# Altium project 202011AWSN.PrjPcb
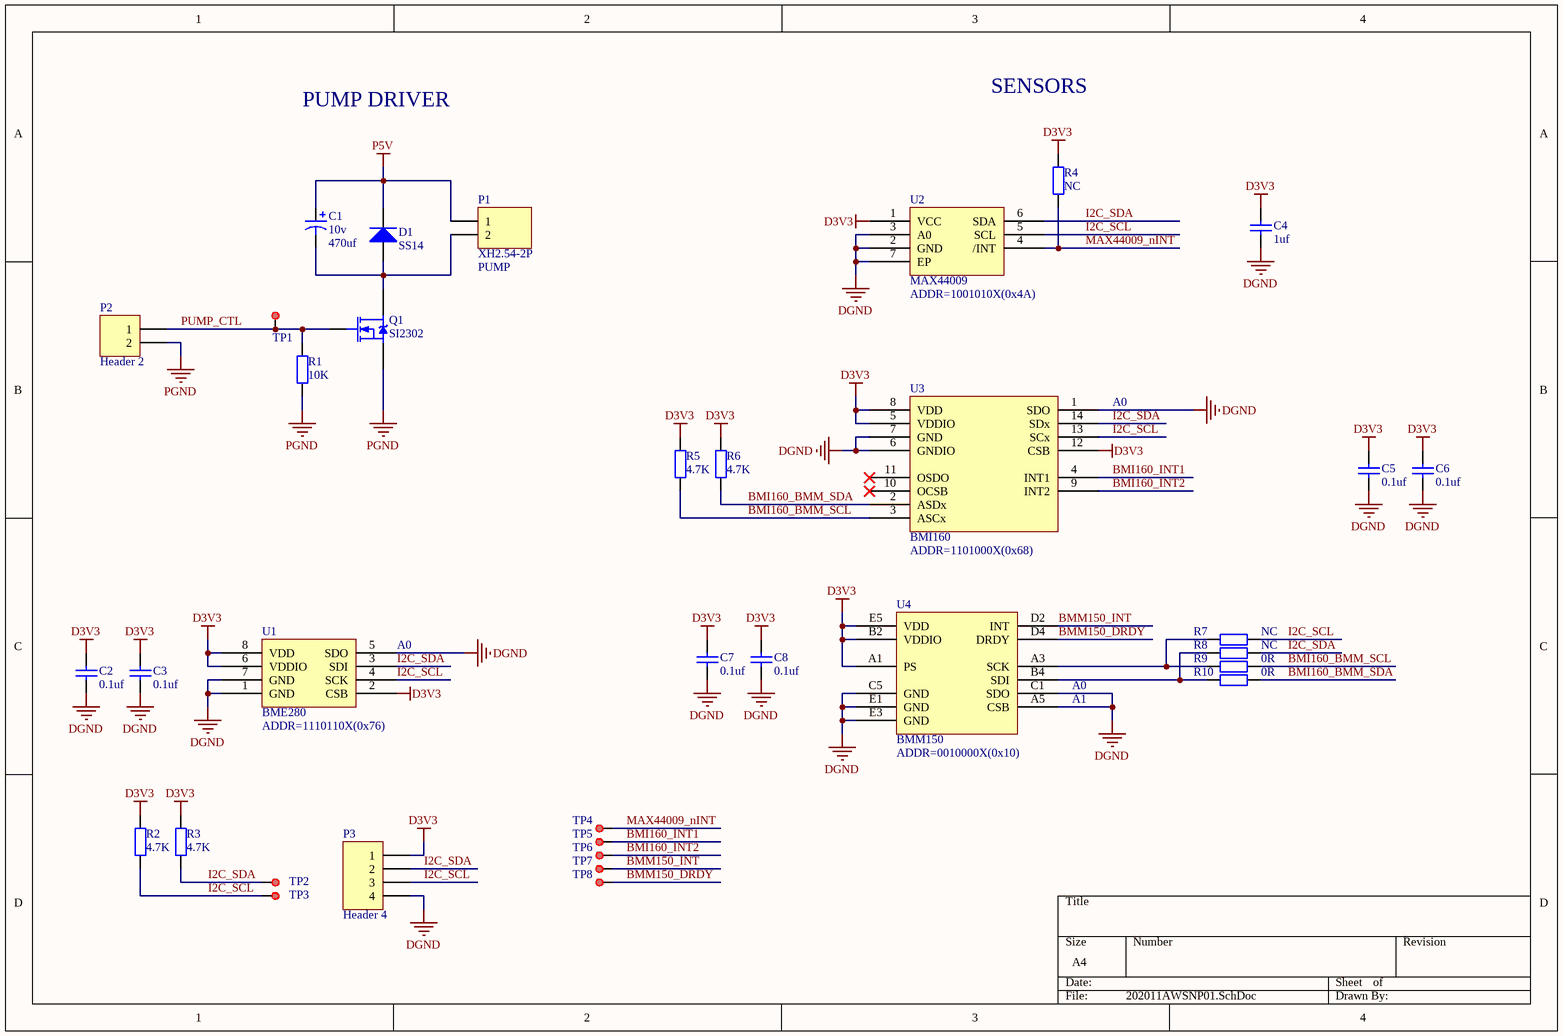
[diagram p0: 202011AWSNP01.SchDoc]
4 sheets, 180 parts. Net scope: global (net labels, ports and power ports of the same name join across sheets).
Board file: 202011AWSN.PcbDoc
Sheets:
  202011AWSNP01.SchDoc
  202011AWSNP02.SchDoc
  202011AWSNP03.SchDoc
  202011AWSNP04.SchDoc

## Sheet 202011AWSNP01.SchDoc
size A4

### Parts
C1  value 470uf  voltage: 10v  [C6.3X7.7-SMD]  (hidden comment: Cap2)
C2  value 0.1uf  [C0603]  (hidden comment: Cap)
C3  value 0.1uf  [C0603]  (hidden comment: Cap)
C4  value 1uf  [C0603]  (hidden comment: Cap)
C5  value 0.1uf  [C0603]  (hidden comment: Cap)
C6  value 0.1uf  [C0603]  (hidden comment: Cap)
C7  value 0.1uf  [C0603]  (hidden comment: Cap)
C8  value 0.1uf  [C0603]  (hidden comment: Cap)
D1  value SS14  [SMA/DO-214AC]  (hidden comment: Diode)
P1  XH2.54-2P  [XH2.54-2P]
P2  Header 2  [HDR1X2]
P3  Header 4  [HDR1X4]
Q1  SI2302  [SI2302-SOT23]
R1  value 10K  [R0805]  (hidden comment: Res)
R2  value 4.7K  [R0603]  (hidden comment: Res)
R3  value 4.7K  [R0603]  (hidden comment: Res)
R4  value NC  [R0603]  (hidden comment: Res)
R5  value 4.7K  [R0603]  (hidden comment: Res)
R6  value 4.7K  [R0603]  (hidden comment: Res)
R7  value NC  [R0603]  (hidden comment: Res)
R8  value NC  [R0603]  (hidden comment: Res)
R9  value 0R  [R0603]  (hidden comment: Res)
R10  value 0R  [R0603]  (hidden comment: Res)
TP1  TestPoint  [TestPoint-R30]  (value not drawn)
TP2  TestPoint  [TestPoint-R30]  (value not drawn)
TP3  TestPoint  [TestPoint-R30]  (value not drawn)
TP4  TestPoint  [TestPoint-R30]  (value not drawn)
TP5  TestPoint  [TestPoint-R30]  (value not drawn)
TP6  TestPoint  [TestPoint-R30]  (value not drawn)
TP7  TestPoint  [TestPoint-R30]  (value not drawn)
TP8  TestPoint  [TestPoint-R30]  (value not drawn)
U1  BME280  [BME280-LGA8]
U2  MAX44009  [MAX44009-UTDFN6]
U3  BMI160  [BMI160-LGA14]
U4  BMM150  [BMM150-BGA12+]

### Nets
D3V3: C2.2 C3.2 C4.1 C5.2 C6.2 C7.2 C8.2 P3.1 R2.2 R3.2 R4.2 R5.2 R6.2 U1.2(CSB) U1.6(VDDIO) U1.8(VDD) U2.1(VCC) U3.5(VDDIO) U3.8(VDD) U3.12(CSB) U4.A1(PS) U4.B2(VDDIO) U4.E5(VDD)
DGND: C2.1 C3.1 C4.2 C5.1 C6.1 C7.1 C8.1 P3.4 U1.1(GND) U1.5(SDO) U1.7(GND) U2.2(GND) U2.3(A0) U2.7(EP) U3.1(SDO) U3.6(GNDIO) U3.7(GND) U4.A5(CSB) U4.C1(SDO) U4.C5(GND) U4.E1(GND) U4.E3(GND)
P5V: C1.1 D1.2(K) P1.1
PGND: P2.2 Q1.2(S) R1.1
BMI160_BMM_SCL: R5.1 R9.1 U3.3(ASCx)
BMI160_BMM_SDA: R6.1 R10.1 U3.2(ASDx)
BMI160_INT1: TP5.1 U3.4(INT1)
BMI160_INT2: TP6.1 U3.9(INT2)
BMM150_DRDY: TP8.1 U4.D4(DRDY)
BMM150_INT: TP7.1 U4.D2(INT)
I2C_SCL: P3.3 R2.1 R7.1 TP3.1 U1.4(SCK) U2.5(SCL) U3.13(SCx)
I2C_SDA: P3.2 R3.1 R8.1 TP2.1 U1.3(SDI) U2.6(SDA) U3.14(SDx)
MAX44009_nINT: R4.1 TP4.1 U2.4(/INT)
PUMP_CTL: P2.1 Q1.1(G) R1.2 TP1.1
NetC1_2: C1.2 D1.1(A) P1.2 Q1.3(D)
NetR7_2: R7.2 R9.2 U4.A3(SCK)
NetR8_2: R8.2 R10.2 U4.B4(SDI)

Not connected (* = marked no-connect by the designer): U3 10(OCSB)* 11(OSDO)*

### Notes on the sheet
- PUMP DRIVER
- SENSORS
- (near P1) PUMP
- (near U2) ADDR=1001010X(0x4A)
- A0
- (near U3) ADDR=1101000X(0x68)
- (near U1) A0
- A1
- (near U1) ADDR=1110110X(0x76)
- (near U4) ADDR=0010000X(0x10)

### Library data of the parts
P2 = Header 2: Header, 2-Pin; LatestRevisionDate: 17-Jul-2002; LatestRevisionNote: Re-released for DXP Platform.; Publisher: Altium Limited
P3 = Header 4: Header, 4-Pin; LatestRevisionDate: 17-Jul-2002; LatestRevisionNote: Re-released for DXP Platform.; Publisher: Altium Limited
Q1 = SI2302: N-Channel 20 V (D-S) MOSFET
R1-R10 = Res: 电阻
TP1-TP8 = TestPoint: 测试点
U1 = BME280: Combined humidity and pressure sensor
U2 = MAX44009: Industry’s Lowest-Power Ambient Light Sensor with ADC
U3 = BMI160: Small, low-power Inertial Measurement Unit
U4 = BMM150: THREE-AXIS GEOMAGNETIC SENSOR

## Sheet 202011AWSNP02.SchDoc
size A4
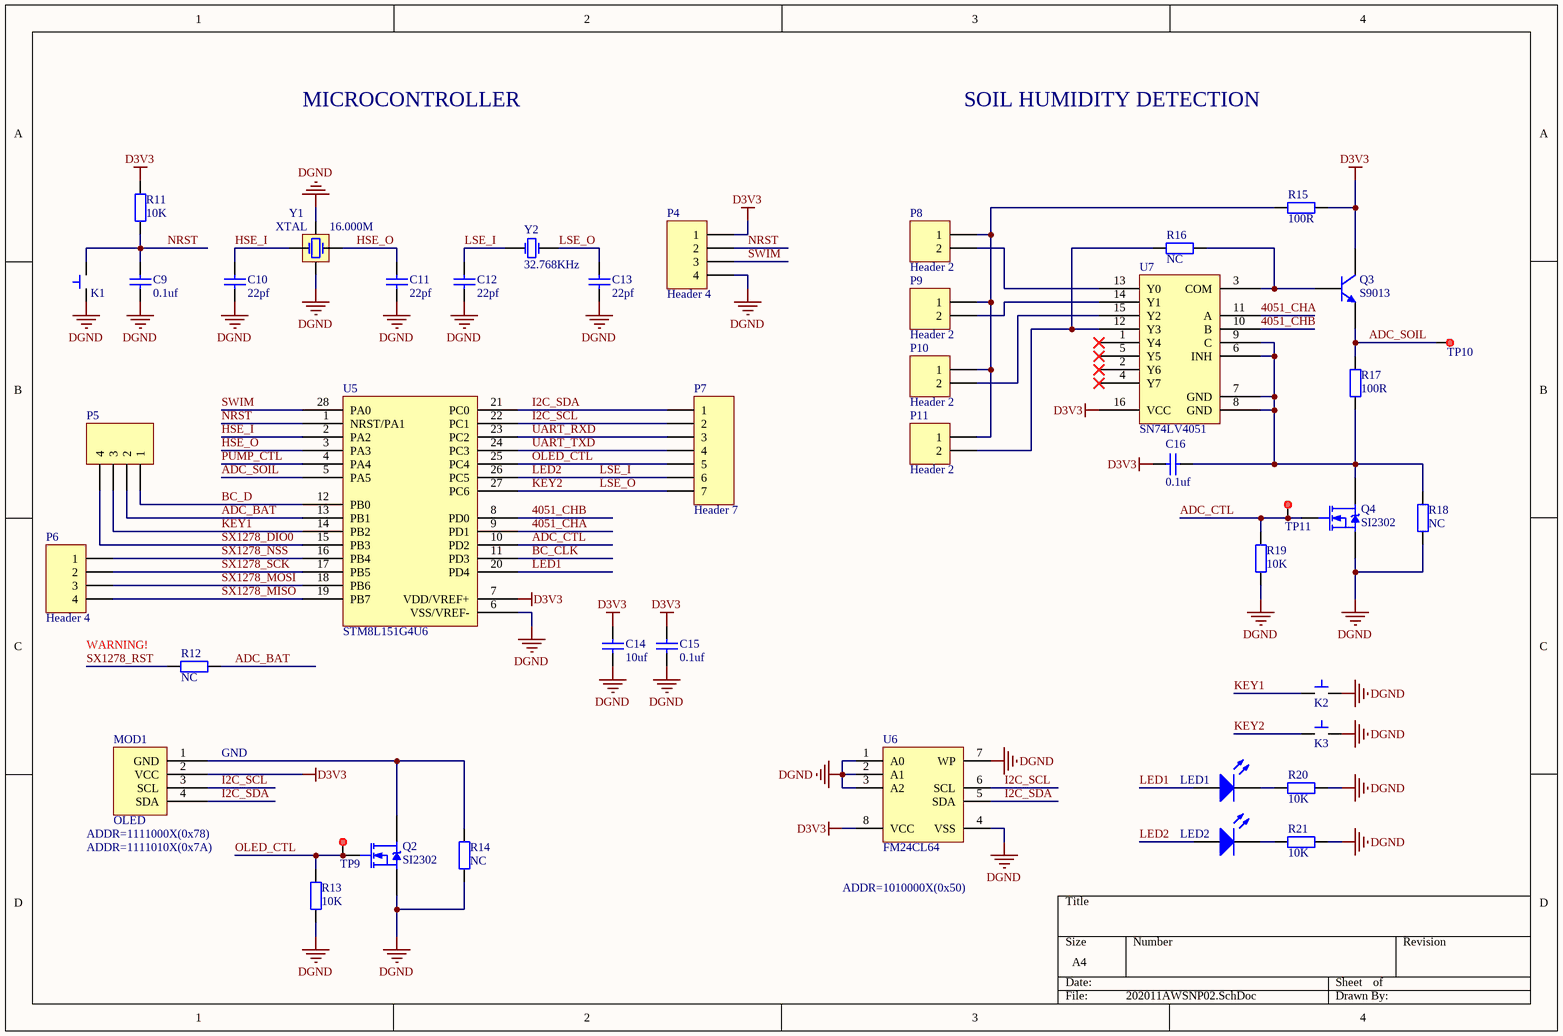
[diagram p1: 202011AWSNP02.SchDoc]

### Parts
C9  value 0.1uf  [C0805]  (hidden comment: Cap)
C10  value 22pf  [C0805]  (hidden comment: Cap)
C11  value 22pf  [C0805]  (hidden comment: Cap)
C12  value 22pf  [C0805]  (hidden comment: Cap)
C13  value 22pf  [C0805]  (hidden comment: Cap)
C14  value 10uf  [C0805]  (hidden comment: Cap)
C15  value 0.1uf  [C0805]  (hidden comment: Cap)
C16  value 0.1uf  [C0805]  (hidden comment: Cap)
K1  Button  [Button-SMT-Small]  (value not drawn)
K2  Button  [Button-SMT-Small]  (value not drawn)
K3  Button  [Button-SMT-Small]  (value not drawn)
LED1  LED  [LED1206]  (value not drawn)
LED2  LED  [LED1206]  (value not drawn)
MOD1  OLED  [MODULE OLED-4P-0.96]
P4  Header 4  [HDR1X4]
P5  Header 4  [HDR1X4]  (value not drawn)
P6  Header 4  [HDR1X4]
P7  Header 7  [HDR1X7]
P8  Header 2  [HDR1X2]
P9  Header 2  [HDR1X2]
P10  Header 2  [HDR1X2]
P11  Header 2  [HDR1X2]
Q2  SI2302  [SI2302-SOT23]
Q3  S9013  [SOT-23]
Q4  SI2302  [SI2302-SOT23]
R11  value 10K  [R0805]  (hidden comment: Res)
R12  value NC  [R0805]  (hidden comment: Res)
R13  value 10K  [R0805]  (hidden comment: Res)
R14  value NC  [R0805]  (hidden comment: Res)
R15  value 100R  [R0805]  (hidden comment: Res)
R16  value NC  [R0805]  (hidden comment: Res)
R17  value 100R  [R0805]  (hidden comment: Res)
R18  value NC  [R0805]  (hidden comment: Res)
R19  value 10K  [R0805]  (hidden comment: Res)
R20  value 10K  [R0805]  (hidden comment: Res)
R21  value 10K  [R0805]  (hidden comment: Res)
TP9  TestPoint  [TestPoint-R30]  (value not drawn)
TP10  TestPoint  [TestPoint-R30]  (value not drawn)
TP11  TestPoint  [TestPoint-R30]  (value not drawn)
U5  STM8L151G4U6  [STM8L151G4U6-UFQFN28]
U6  FM24CL64  [FM24CL64-SOIC8]
U7  SN74LV4051  [SN74LV4051-TSSOP16]
Y1  XTAL  value 16.000M  [XTAL-3225]
Y2  value 32.768KHz  [XTAL-3215]  (hidden comment: XTAL)

### Nets
D3V3: C14.2 C15.2 C16.2 MOD1.2(VCC) P4.1 Q3.C R11.1 R15.2 U5.7(VDD/VREF+) U6.8(VCC) U7.16(VCC)
DGND: C9.1 C10.1 C11.1 C12.1 C13.1 C14.1 C15.1 K1.2(OUT) K2.2(OUT) K3.2(OUT) P4.4 Q2.2(S) Q4.2(S) R13.1 R14.1 R18.1 R19.1 R20.1 R21.1 U5.6(VSS/VREF-) U6.1(A0) U6.2(A1) U6.3(A2) U6.4(VSS) U6.7(WP) Y1.2(GND) Y1.4(GND)
4051_CHA: U5.9(PD1) U7.11(A)
4051_CHB: U5.8(PD0) U7.10(B)
ADC_BAT: P5.2 R12.1 U5.13(PB1)
ADC_CTL: Q4.1(G) R19.2 TP11.1 U5.10(PD2)
ADC_SOIL: Q3.E R17.2 TP10.1 U5.5(PA5)
BC_CLK: U5.11(PD3)
BC_D: P5.1 U5.12(PB0)
HSE_I: C10.2 U5.2(PA2) Y1.1(OSC1)
HSE_O: C11.2 U5.3(PA3) Y1.3(OSC2)
I2C_SCL: MOD1.3(SCL) P7.2 U5.22(PC1) U6.6(SCL)
I2C_SDA: MOD1.4(SDA) P7.1 U5.21(PC0) U6.5(SDA)
KEY1: K2.1(IN) P5.3 U5.14(PB2)
KEY2: C13.2 K3.1(IN) P7.7 U5.27(PC6) Y2.2(OSC2)  [also labelled LSE_O]
LED1: LED1.1(A) U5.20(PD4)
LED2: C12.2 LED2.1(A) P7.6 U5.26(PC5) Y2.1(OSC1)  [also labelled LSE_I]
NRST: C9.2 K1.1(IN) P4.2 R11.2 U5.1(NRST/PA1)
OLED_CTL: P7.5 Q2.1(G) R13.2 TP9.1 U5.25(PC4)
PUMP_CTL: U5.4(PA4)
SWIM: P4.3 U5.28(PA0)
SX1278_DIO0: P5.4 U5.15(PB3)  [project net 8266_IO2]
SX1278_MISO: P6.4 U5.19(PB7)  [project net 8266_MISO]
SX1278_MOSI: P6.3 U5.18(PB6)  [project net 8266_MOSI]
SX1278_NSS: P6.1 U5.16(PB4)  [project net 8266_NSS]
SX1278_RST: R12.2
SX1278_SCK: P6.2 U5.17(PB5)  [project net 8266_CLK]
UART_RXD: P7.3 U5.23(PC2)
UART_TXD: P7.4 U5.24(PC3)
NetC16_1: C16.1 Q4.3(D) R17.1 R18.2 U7.6(INH) U7.7(GND) U7.8(GND) U7.9(C)
NetLED1_2: LED1.2(K) R20.2
NetLED2_2: LED2.2(K) R21.2
NetMOD1_1: MOD1.1(GND) Q2.3(D) R14.2
NetP8_1: P8.1 P9.1 P10.1 P11.1 R15.1
NetP8_2: P8.2 U7.13(Y0)
NetP9_2: P9.2 U7.14(Y1)
NetP10_2: P10.2 U7.15(Y2)
NetP11_2: P11.2 R16.1 U7.12(Y3)
NetQ3_B: Q3.B R16.2 U7.3(COM)

Not connected (* = marked no-connect by the designer): U7 1(Y4)* 2(Y6)* 4(Y7)* 5(Y5)*

### Notes on the sheet
- MICROCONTROLLER
- SOIL HUMIDITY DETECTION
- WARNING!
- GND
- (near MOD1) ADDR=1111000X(0x78)
- (near MOD1) ADDR=1111010X(0x7A)
- ADDR=1010000X(0x50)

### Library data of the parts
K1-K3 = Button: 轻触开关
MOD1 = Module OLED: OLED显示模块
P4-P6 = Header 4: Header, 4-Pin; LatestRevisionDate: 17-Jul-2002; LatestRevisionNote: Re-released for DXP Platform.; Publisher: Altium Limited
P7 = Header 7: Header, 7-Pin; LatestRevisionDate: 17-Jul-2002; LatestRevisionNote: Re-released for DXP Platform.; Publisher: Altium Limited
P8-P11 = Header 2: Header, 2-Pin; LatestRevisionDate: 17-Jul-2002; LatestRevisionNote: Re-released for DXP Platform.; Publisher: Altium Limited
Q2 Q4 = SI2302: N-Channel 20 V (D-S) MOSFET
Q3 = NPN: NPN General Purpose Amplifier
R11-R21 = Res: 电阻
TP9-TP11 = TestPoint: 测试点
U5 = STM8L151G4U6: 8-bit ultra-low-power MCU, up to 32 KB Flash, 1 KB Data EEPROM,RTC, LCD, timers, USART, I2C, SPI, ADC, DAC, comparators
U6 = FM24CL64: 64Kb Serial 3V FRAM Memory
U7 = SN74LV4051: SN74LV4051A 8-Channel Analog Multiplexers and Demultiplexers
Y1 = XTAL3: 无源晶振
Y2 = XTAL: Crystal Oscillator

## Sheet 202011AWSNP03.SchDoc
size A4
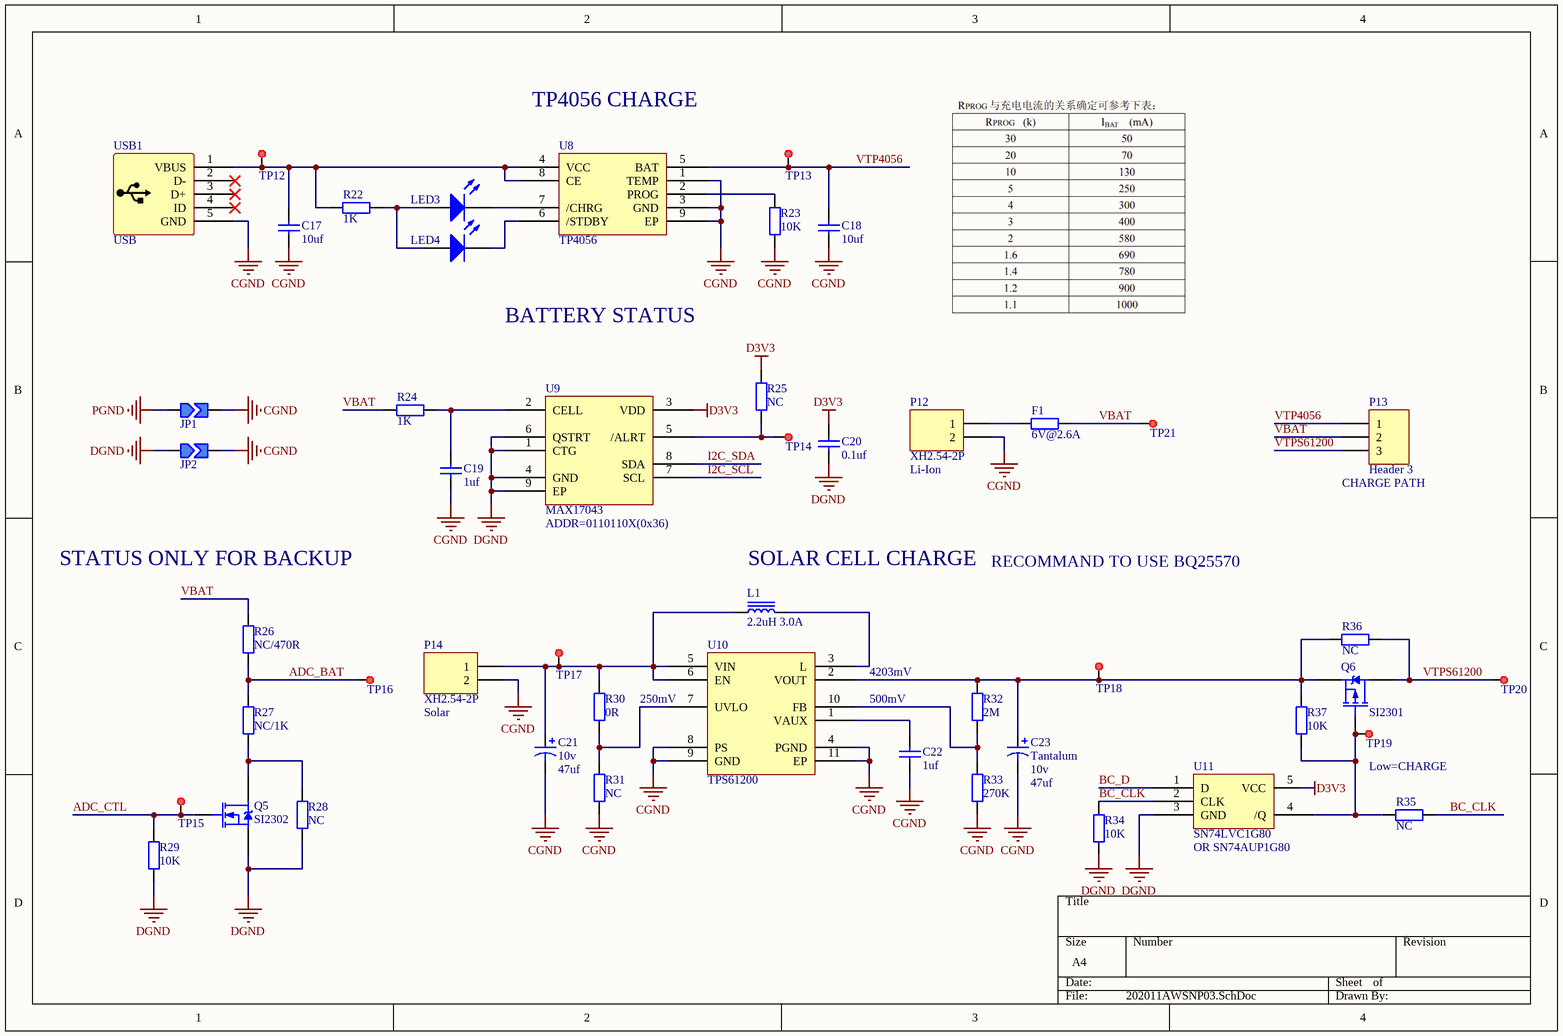
[diagram p2: 202011AWSNP03.SchDoc]

### Parts
C17  value 10uf  [C0805]  (hidden comment: Cap)
C18  value 10uf  [C0805]  (hidden comment: Cap)
C19  value 1uf  [C0805]  (hidden comment: Cap)
C20  value 0.1uf  [C0805]  (hidden comment: Cap)
C21  value 47uf  voltage: 10v  [C4X5.4-SMD]  (hidden comment: Cap2)
C22  value 1uf  [C0805]  (hidden comment: Cap)
C23  Tantalum  value 47uf  voltage: 10v  [C1210T-3528B]
F1  value 6V@2.6A  [F1812]  (hidden comment: Fuse)
JP1  Jumper  [Jumper-2]  (value not drawn)
JP2  Jumper  [Jumper-2]  (value not drawn)
L1  value 2.2uH 3.0A  [L04042]  (hidden comment: Inductor Iron)
LED3  LED  [LED1206]  (value not drawn)
LED4  LED  [LED1206]  (value not drawn)
P12  XH2.54-2P  [XH2.54-2P]
P13  Header 3  [HDR1X3]
P14  XH2.54-2P  [XH2.54-2P]
Q5  SI2302  [SI2302-SOT23]
Q6  SI2301  [SI2301-SOT23]
R22  value 1K  [R0805]  (hidden comment: Res)
R23  value 10K  [R0805]  (hidden comment: Res)
R24  value 1K  [R0805]  (hidden comment: Res)
R25  value NC  [R0805]  (hidden comment: Res)
R26  value NC/470R  [R0805]  (hidden comment: Res)
R27  value NC/1K  [R0805]  (hidden comment: Res)
R28  value NC  [R0805]  (hidden comment: Res)
R29  value 10K  [R0805]  (hidden comment: Res)
R30  value 0R  [R0805]  (hidden comment: Res)
R31  value NC  [R0805]  (hidden comment: Res)
R32  value 2M  [R0805]  (hidden comment: Res)
R33  value 270K  [R0805]  (hidden comment: Res)
R34  value 10K  [R0805]  (hidden comment: Res)
R35  value NC  [R0805]  (hidden comment: Res)
R36  value NC  [R0805]  (hidden comment: Res)
R37  value 10K  [R0805]  (hidden comment: Res)
TP12  TestPoint  [TestPoint-R30]  (value not drawn)
TP13  TestPoint  [TestPoint-R30]  (value not drawn)
TP14  TestPoint  [TestPoint-R30]  (value not drawn)
TP15  TestPoint  [TestPoint-R30]  (value not drawn)
TP16  TestPoint  [TestPoint-R30]  (value not drawn)
TP17  TestPoint  [TestPoint-R30]  (value not drawn)
TP18  TestPoint  [TestPoint-R30]  (value not drawn)
TP19  TestPoint  [TestPoint-R30]  (value not drawn)
TP20  TestPoint  [TestPoint-R30]  (value not drawn)
TP21  TestPoint  [TestPoint-R30]  (value not drawn)
U8  TP4056  [TP4056-SOIC8]
U9  MAX17043  [MAX17043-TDFN8]
U10  TPS61200  [TPS61200-VSON10]
U11  SN74LVC1G80  [SN74LVC1G80-SC70]
USB1  USB  [USB-Mini-SMT]

### Nets
CGND: C17.1 C18.1 C19.1 C21.2 C22.1 C23.2 JP1.2 JP2.2 P12.2 P14.2 R23.2 R31.2 R33.2 U8.1(TEMP) U8.3(GND) U8.9(EP) U10.4(PGND) U10.8(PS) U10.9(GND) U10.11(EP) USB1.5(GND)
D3V3: C20.2 R25.1 U9.3(VDD) U11.5(VCC)
DGND: C20.1 JP2.1 Q5.2(S) R28.1 R29.1 R34.2 U9.1(CTG) U9.4(GND) U9.6(QSTRT) U9.9(EP) U11.3(GND)
PGND: JP1.1
ADC_BAT: R26.1 R27.2 TP16.1
ADC_CTL: Q5.1(G) R29.2 TP15.1
BC_CLK: R34.1 R35.1 U11.2(CLK)
BC_D: U11.1(D)
I2C_SCL: U9.7(SCL)
I2C_SDA: U9.8(SDA)
VBAT: F1.2 P13.2 R24.2 R26.2 TP21.1
VTP4056: C18.2 P13.1 TP13.1 U8.5(BAT)
VTPS61200: P13.3 Q6.3(D) R36.1 TP20.1
NetC17_2: C17.2 R22.2 TP12.1 U8.4(VCC) U8.8(CE) USB1.1(VBUS)
NetC19_2: C19.2 R24.1 U9.2(CELL)
NetC21_1: C21.1 L1.1 P14.1 R30.1 TP17.1 U10.5(VIN) U10.6(EN)
NetC22_2: C22.2 U10.1(VAUX)
NetC23_1: C23.1 Q6.2(S) R32.1 R36.2 R37.1 TP18.1 U10.2(VOUT)
NetF1_1: F1.1 P12.1
NetL1_2: L1.2 U10.3(L)
NetLED3_1: LED3.1(A) LED4.1(A) R22.1
NetLED3_2: LED3.2(K) U8.7(/CHRG)
NetLED4_2: LED4.2(K) U8.6(/STDBY)
NetQ5_3: Q5.3(D) R27.1 R28.2
NetQ6_1: Q6.1(G) R35.2 R37.2 TP19.1 U11.4(/Q)
NetR23_1: R23.1 U8.2(PROG)
NetR25_2: R25.2 TP14.1 U9.5(/ALRT)
NetR30_2: R30.2 R31.1 U10.7(UVLO)
NetR32_2: R32.2 R33.1 U10.10(FB)

Not connected (* = marked no-connect by the designer): USB1 2(D-)* 3(D+)* 4(ID)*

### Notes on the sheet
- TP4056 CHARGE
- BATTERY STATUS
- (near P12) Li-Ion
- (near P13) CHARGE PATH
- STATUS ONLY FOR BACKUP
- (near U9) ADDR=0110110X(0x36)
- (near L1) SOLAR CELL CHARGE
- RECOMMAND TO USE BQ25570
- (near P14) Solar
- 250mV
- 500mV
- 4203mV
- Low=CHARGE
- (near U11) OR SN74AUP1G80

### Library data of the parts
C23 = Cap-Tantalum
L1 = Inductor Iron: Magnetic-Core Inductor
P13 = Header 3: Header, 3-Pin; LatestRevisionDate: 17-Jul-2002; LatestRevisionNote: Re-released for DXP Platform.; Publisher: Altium Limited
Q5 = SI2302: N-Channel 20 V (D-S) MOSFET
Q6 = SI2301: P-Channel 20 V (D-S) MOSFET
R22-R37 = Res: 电阻
TP12-TP21 = TestPoint: 测试点
U8 = TP4056: 1A 线性锂离子电池充电器
U9 = MAX17043: 1-Cell/2-Cell Fuel Gauge with ModelGauge and Low-Battery Alert
U10 = TPS61200: TPS61200x Low Input Voltage Synchronous Boost Converter With 1.3-A Switches
U11 = SN74LVC1G80: Single Positive-Edge-Triggered D-Type Flip-Flop

## Sheet 202011AWSNP04.SchDoc
size A4
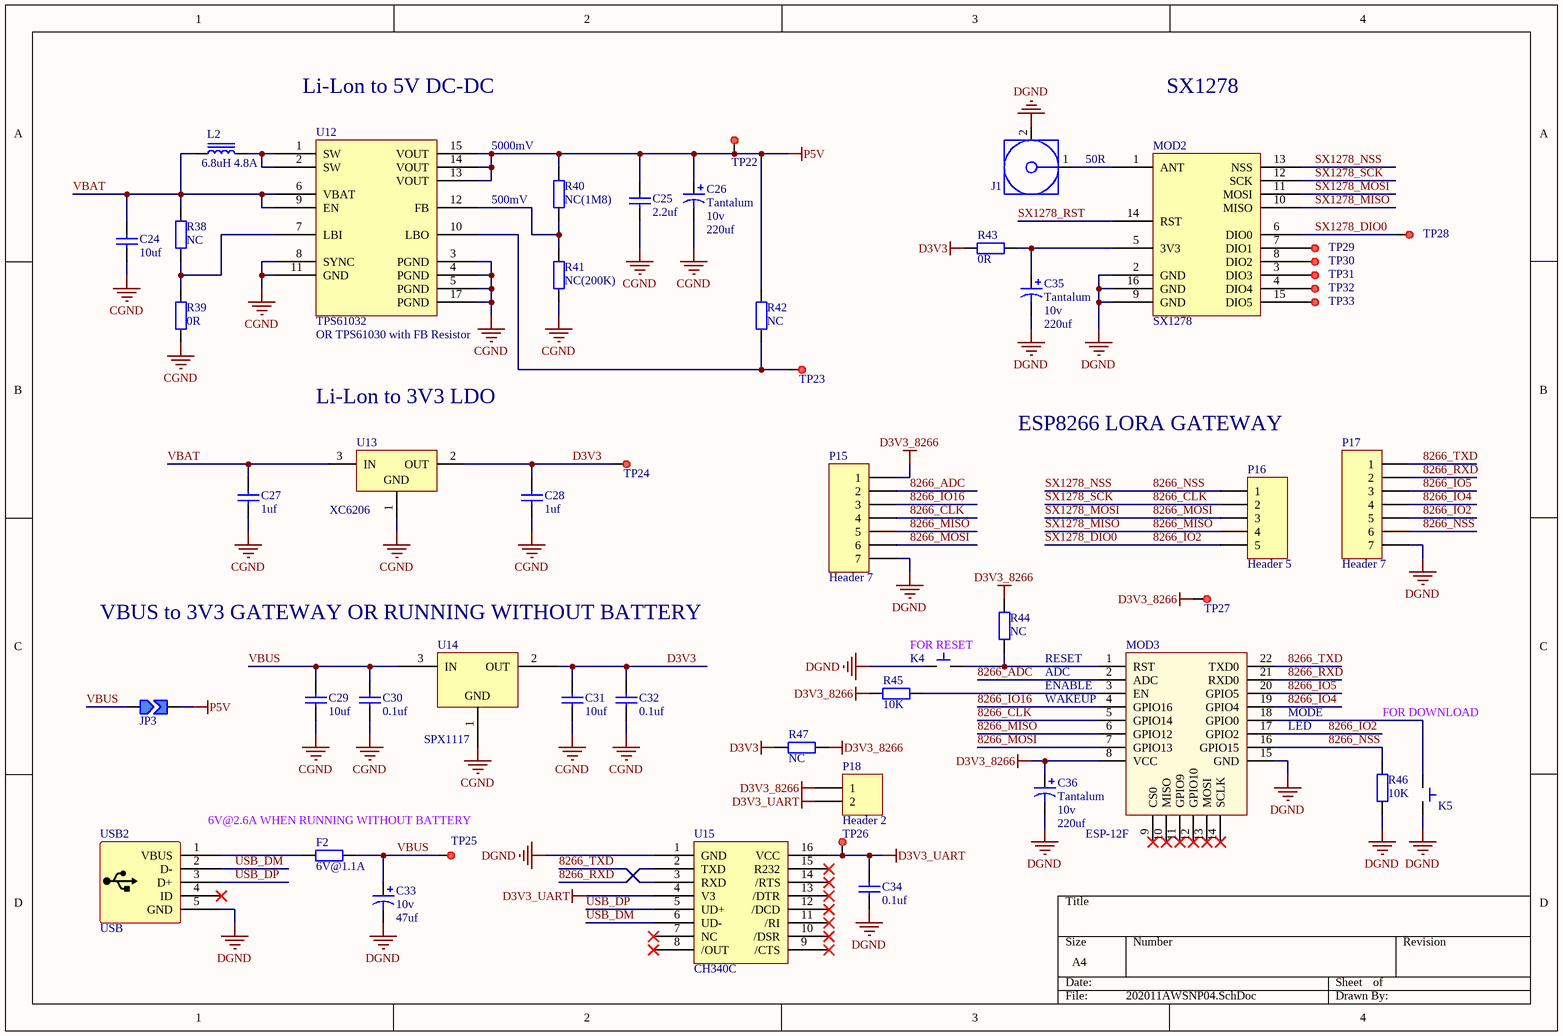
[diagram p3: 202011AWSNP04.SchDoc]

### Parts
C24  value 10uf  [C0805]  (hidden comment: Cap)
C25  value 2.2uf  [C0805]  (hidden comment: Cap)
C26  Tantalum  value 220uf  voltage: 10v  [C2917T-7343D]
C27  value 1uf  [C0805]  (hidden comment: Cap)
C28  value 1uf  [C0805]  (hidden comment: Cap)
C29  value 10uf  [C0805]  (hidden comment: Cap)
C30  value 0.1uf  [C0805]  (hidden comment: Cap)
C31  value 10uf  [C0805]  (hidden comment: Cap)
C32  value 0.1uf  [C0805]  (hidden comment: Cap)
C33  value 47uf  voltage: 10v  [C4X5.4-SMD]  (hidden comment: Cap2)
C34  value 0.1uf  [C0805]  (hidden comment: Cap)
C35  Tantalum  value 220uf  voltage: 10v  [C2917T-7343D]
C36  Tantalum  value 220uf  voltage: 10v  [C2917T-7343D]
F2  value 6V@1.1A  [F1812]  (hidden comment: Fuse)
J1  SMA  [SMA-3]  (value not drawn)
JP3  Jumper  [Jumper-2]  (value not drawn)
K4  Button  [Button-SMT-Small]  (value not drawn)
K5  Button  [Button-SMT-Small]  (value not drawn)
L2  value 6.8uH 4.8A  [L10104]  (hidden comment: Inductor Iron)
MOD2  SX1278  [MODULE SX1278]
MOD3  ESP-12F  [MODULE ESP-12F]
P15  Header 7  [HDR1X7]
P16  Header 5  [HDR1X5]
P17  Header 7  [HDR1X7]
P18  Header 2  [HDR1X2]
R38  value NC  [R0805]  (hidden comment: Res)
R39  value 0R  [R0805]  (hidden comment: Res)
R40  value NC(1M8)  [R0805]  (hidden comment: Res)
R41  value NC(200K)  [R0805]  (hidden comment: Res)
R42  value NC  [R0805]  (hidden comment: Res)
R43  value 0R  [R0805]  (hidden comment: Res)
R44  value NC  [R0805]  (hidden comment: Res)
R45  value 10K  [R0805]  (hidden comment: Res)
R46  value 10K  [R0805]  (hidden comment: Res)
R47  value NC  [R0805]  (hidden comment: Res)
TP22  TestPoint  [TestPoint-R30]  (value not drawn)
TP23  TestPoint  [TestPoint-R30]  (value not drawn)
TP24  TestPoint  [TestPoint-R30]  (value not drawn)
TP25  TestPoint  [TestPoint-R30]  (value not drawn)
TP26  TestPoint  [TestPoint-R30]  (value not drawn)
TP27  TestPoint  [TestPoint-R30]  (value not drawn)
TP28  TestPoint  [TestPoint-R30]  (value not drawn)
TP29  TestPoint  [TestPoint-R30]  (value not drawn)
TP30  TestPoint  [TestPoint-R30]  (value not drawn)
TP31  TestPoint  [TestPoint-R30]  (value not drawn)
TP32  TestPoint  [TestPoint-R30]  (value not drawn)
TP33  TestPoint  [TestPoint-R30]  (value not drawn)
U12  TPS61032  [TPS61030-TSSOP16]
U13  XC6206  [XC6206-SOT23]
U14  SPX1117  [SPX1117-SOT223]
U15  CH340C  [CH340C-SOP16]
USB2  USB  [USB-Mini-SMT]

### Nets
CGND: C24.1 C25.1 C26.2 C27.1 C28.1 C29.1 C30.1 C31.1 C32.1 R39.2 R41.2 U12.3(PGND) U12.4(PGND) U12.5(PGND) U12.8(SYNC) U12.11(GND) U12.17(PGND) U13.1(GND) U14.1(GND)
D3V3: C28.2 C31.2 C32.2 R43.2 R47.1 TP24.1 U13.2(OUT) U14.2(OUT)
D3V3_8266: C36.1 MOD3.8(VCC) P15.1 P18.1 R44.1 R45.1 R47.2 TP27.1
D3V3_UART: C34.1 P18.2 TP26.1 U15.4(V3) U15.16(VCC)
DGND: C33.2 C34.2 C35.2 C36.2 J1.2(GND) K4.1(IN) K5.2(OUT) MOD2.2(GND) MOD2.9(GND) MOD2.16(GND) MOD3.15(GND) P15.7 P17.7 R46.1 U15.1(GND) USB2.5(GND)
P5V: C25.2 C26.1 JP3.2 R40.1 R42.1 TP22.1 U12.13(VOUT) U12.14(VOUT) U12.15(VOUT)
8266_ADC: MOD3.2(ADC) P15.2
8266_CLK: MOD2.12(SCK) MOD3.5(GPIO14) P15.4 P16.2  [also labelled SX1278_SCK]
8266_IO2: MOD2.6(DIO0) MOD3.17(GPIO2) P16.5 P17.5 TP28.1  [also labelled SX1278_DIO0]
8266_IO4: MOD3.19(GPIO4) P17.4
8266_IO5: MOD3.20(GPIO5) P17.3
8266_IO16: MOD3.4(GPIO16) P15.3
8266_MISO: MOD2.10(MISO) MOD3.6(GPIO12) P15.5 P16.4  [also labelled SX1278_MISO]
8266_MOSI: MOD2.11(MOSI) MOD3.7(GPIO13) P15.6 P16.3  [also labelled SX1278_MOSI]
8266_NSS: MOD2.13(NSS) MOD3.16(GPIO15) P16.1 P17.6 R46.2  [also labelled SX1278_NSS]
8266_RXD: MOD3.21(RXD0) P17.2 U15.2(TXD)
8266_TXD: MOD3.22(TXD0) P17.1 U15.3(RXD)
SX1278_RST: MOD2.14(RST)
USB_DM: U15.6(UD-) USB2.2(D-)
USB_DP: U15.5(UD+) USB2.3(D+)
VBAT: C24.2 C27.2 L2.1 R38.1 U12.6(VBAT) U12.9(EN) U13.3(IN)
VBUS: C29.2 C30.2 C33.1 F2.2 JP3.1 TP25.1 U14.3(IN)
NetC35_1: C35.1 MOD2.5(3V3) R43.1
NetF2_1: F2.1 USB2.1(VBUS)
NetJ1_1: J1.1(Signal) MOD2.1(ANT)
NetK4_2: K4.2(OUT) MOD3.1(RST) R44.2
NetK5_1: K5.1(IN) MOD3.18(GPIO0)
NetL2_2: L2.2 U12.1(SW) U12.2(SW)
NetMOD2_3: MOD2.3(DIO3) TP31.1
NetMOD2_4: MOD2.4(DIO4) TP32.1
NetMOD2_7: MOD2.7(DIO1) TP29.1
NetMOD2_8: MOD2.8(DIO2) TP30.1
NetMOD2_15: MOD2.15(DIO5) TP33.1
NetMOD3_3: MOD3.3(EN) R45.2
NetR38_2: R38.2 R39.1 U12.7(LBI)
NetR40_2: R40.2 R41.1 U12.12(FB)
NetR42_2: R42.2 TP23.1 U12.10(LBO)

Not connected (* = marked no-connect by the designer): MOD3 9(CS0)* 10(MISO)* 11(GPIO9)* 12(GPIO10)* 13(MOSI)* 14(SCLK)*; U15 7(NC)* 8(/OUT)* 9(/CTS)* 10(/DSR)* 11(/RI)* 12(/DCD)* 13(/DTR)* 14(/RTS)* 15(R232)*; USB2 4(ID)*

### Notes on the sheet
- Li-Lon to 5V DC-DC
- SX1278
- 5000mV
- (near J1) 50R
- 500mV
- (near U12) OR TPS61030 with FB Resistor
- Li-Lon to 3V3 LDO
- ESP8266 LORA GATEWAY
- (near U14) VBUS to 3V3 GATEWAY OR RUNNING WITHOUT BATTERY
- (near K4) FOR RESET
- WAKEUP
- ENABLE
- RESET
- ADC
- (near MOD3) MODE
- FOR DOWNLOAD
- (near MOD3) LED
- 6V@2.6A WHEN RUNNING WITHOUT BATTERY

### Library data of the parts
C26 C35 C36 = Cap-Tantalum
K4 K5 = Button: 轻触开关
L2 = Inductor Iron: Magnetic-Core Inductor
MOD2 = Module SX1278
MOD3 = Module ESP-12F
P15 P17 = Header 7: Header, 7-Pin; LatestRevisionDate: 17-Jul-2002; LatestRevisionNote: Re-released for DXP Platform.; Publisher: Altium Limited
P16 = Header 5: Header, 5-Pin; LatestRevisionDate: 17-Jul-2002; LatestRevisionNote: Re-released for DXP Platform.; Publisher: Altium Limited
P18 = Header 2: Header, 2-Pin; LatestRevisionDate: 17-Jul-2002; LatestRevisionNote: Re-released for DXP Platform.; Publisher: Altium Limited
R38-R47 = Res: 电阻
TP22-TP33 = TestPoint: 测试点
U12 = TPS61032PWP: TPS6103x 96% Efficient Synchronous Boost Converter With 4A Switch
U13 = XC6206: Low ESR Cap. Compatible Positive Voltage Regulators
U14 = SPX1117: 800mA Low Dropout Voltage Regulator
U15 = CH340C: USB 转串口芯片

## Nets that join several sheets
CGND: 202011AWSNP03 (21 pins), 202011AWSNP04 (19 pins)
D3V3: 202011AWSNP01 (23 pins), 202011AWSNP02 (11 pins), 202011AWSNP03 (C20.2 R25.1 U9.3 U11.5), 202011AWSNP04 (8 pins)
DGND: 202011AWSNP01 (22 pins), 202011AWSNP02 (27 pins), 202011AWSNP03 (11 pins), 202011AWSNP04 (16 pins)
P5V: 202011AWSNP01 (C1.1 D1.2 P1.1), 202011AWSNP04 (9 pins)
PGND: 202011AWSNP01 (P2.2 Q1.2 R1.1), 202011AWSNP03 (JP1.1)
8266_CLK: 202011AWSNP02 (P6.2 U5.17), 202011AWSNP04 (MOD2.12 MOD3.5 P15.4 P16.2)
8266_IO2: 202011AWSNP02 (P5.4 U5.15), 202011AWSNP04 (5 pins)
8266_MISO: 202011AWSNP02 (P6.4 U5.19), 202011AWSNP04 (MOD2.10 MOD3.6 P15.5 P16.4)
8266_MOSI: 202011AWSNP02 (P6.3 U5.18), 202011AWSNP04 (MOD2.11 MOD3.7 P15.6 P16.3)
8266_NSS: 202011AWSNP02 (P6.1 U5.16), 202011AWSNP04 (5 pins)
ADC_BAT: 202011AWSNP02 (P5.2 R12.1 U5.13), 202011AWSNP03 (R26.1 R27.2 TP16.1)
ADC_CTL: 202011AWSNP02 (Q4.1 R19.2 TP11.1 U5.10), 202011AWSNP03 (Q5.1 R29.2 TP15.1)
BC_CLK: 202011AWSNP02 (U5.11), 202011AWSNP03 (R34.1 R35.1 U11.2)
BC_D: 202011AWSNP02 (P5.1 U5.12), 202011AWSNP03 (U11.1)
I2C_SCL: 202011AWSNP01 (7 pins), 202011AWSNP02 (MOD1.3 P7.2 U5.22 U6.6), 202011AWSNP03 (U9.7)
I2C_SDA: 202011AWSNP01 (7 pins), 202011AWSNP02 (MOD1.4 P7.1 U5.21 U6.5), 202011AWSNP03 (U9.8)
PUMP_CTL: 202011AWSNP01 (P2.1 Q1.1 R1.2 TP1.1), 202011AWSNP02 (U5.4)
SX1278_RST: 202011AWSNP02 (R12.2), 202011AWSNP04 (MOD2.14)
VBAT: 202011AWSNP03 (5 pins), 202011AWSNP04 (7 pins)